# EAGLE schematic GBox2-can_diy (EAGLE 6.6.0)
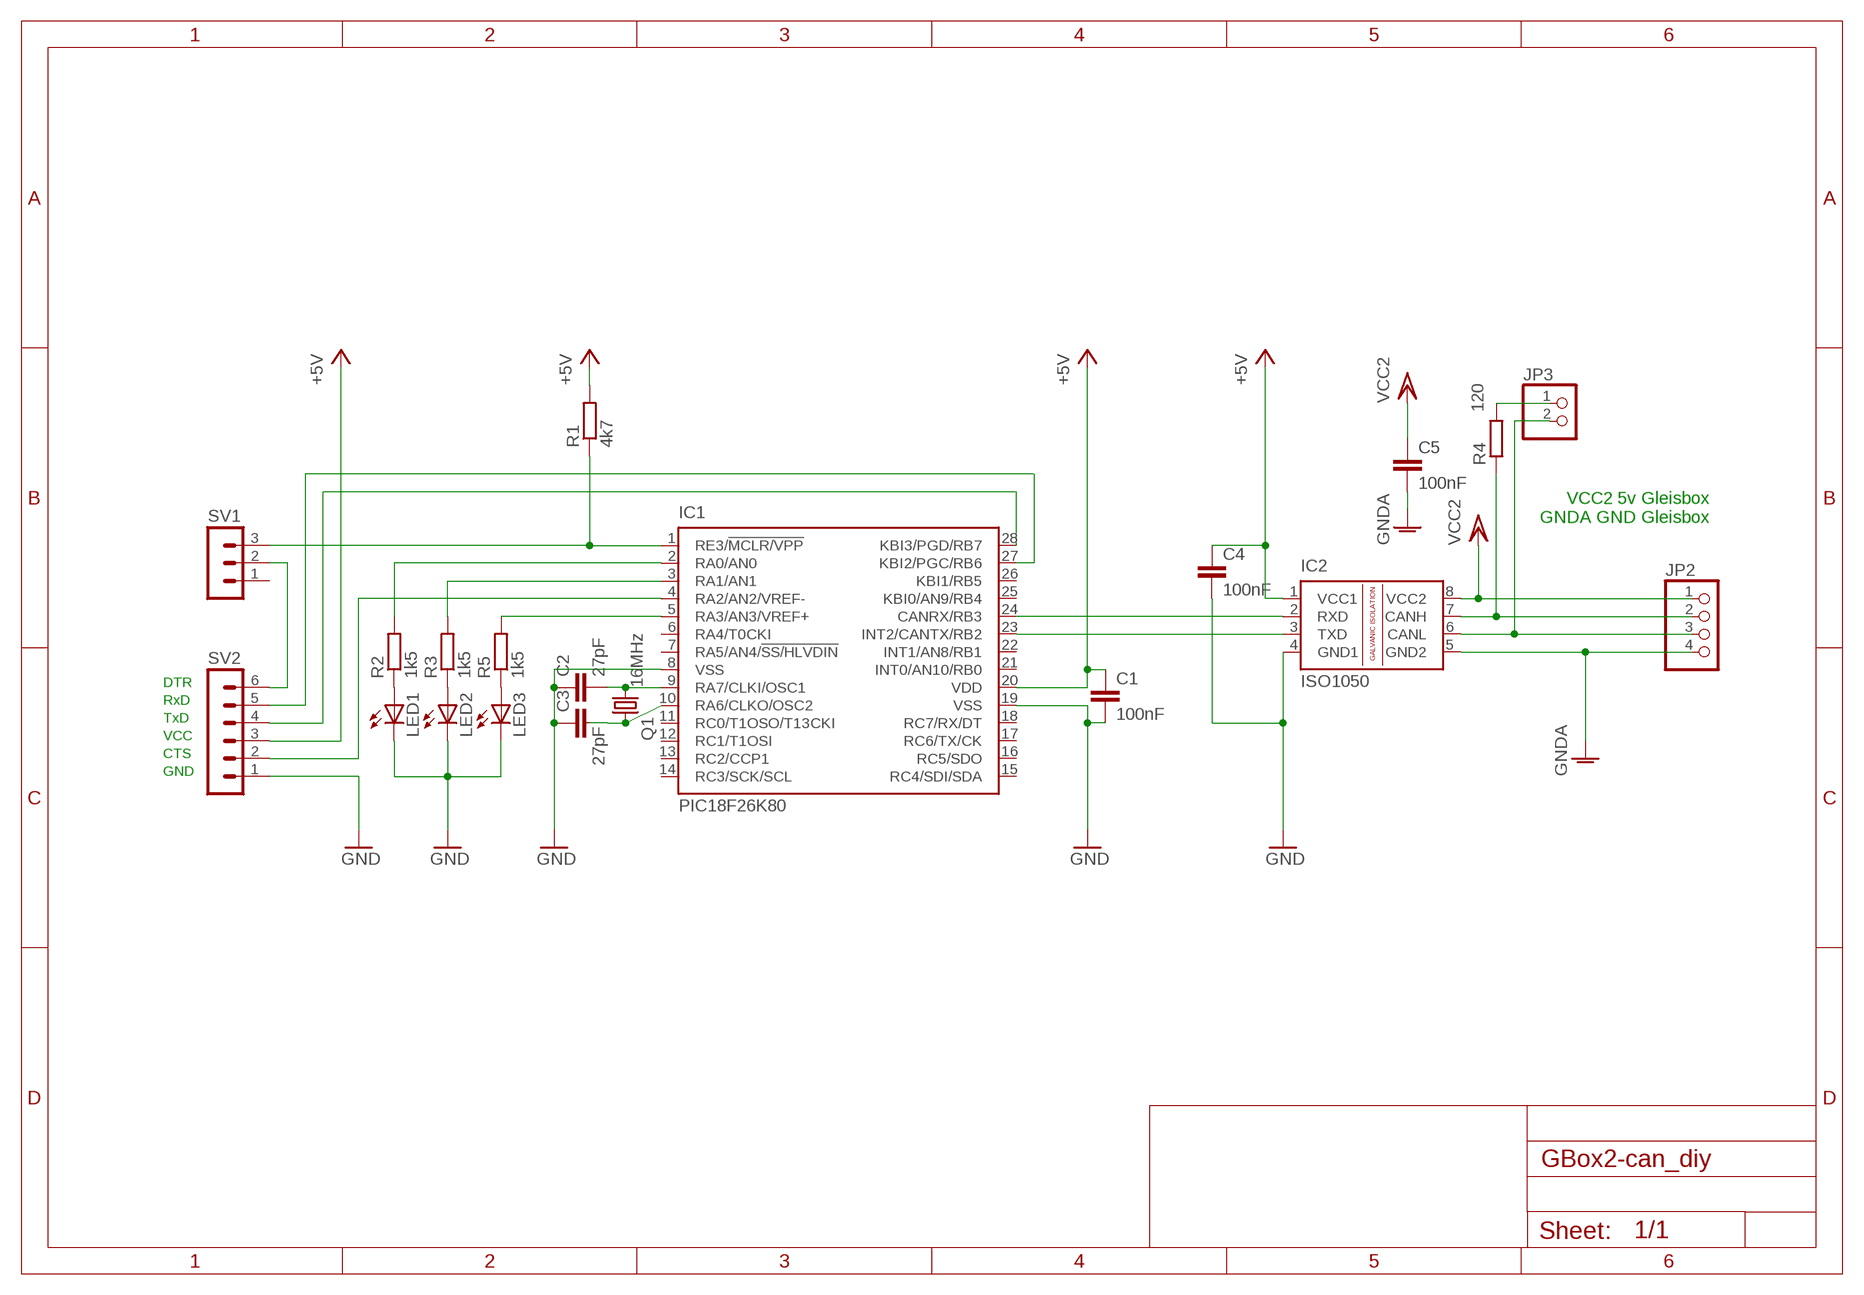
[diagram p0: schematic, sheet 1]

## Parts
C1  100nF  C-EUC1206  [C1206]
C2  27pF  C-EUC1206  [C1206]
C3  27pF  C-EUC1206  [C1206]
C4  100nF  C-EUC1206  [C1206]
C5  100nF  C-EUC1206  [C1206]
IC1  PIC18F26K80  PIC18F26K80-E/SO  [SO28W]
IC2  ISO1050  ISO1050DUB  [DUB-R-PDSO-G8]
JP2  PINHD-1X4  [1X04]
JP3  PINHD-1X2  [1X02]
LED1  LEDSML1206  [SML1206]
LED2  LEDSML1206  [SML1206]
LED3  LEDSML1206  [SML1206]
Q1  16MHz  CRYSTALHC49UP  [HC49UP]
R1  4k7  R-EU_R1206  [R1206]
R2  1k5  R-EU_R1206  [R1206]
R3  1k5  R-EU_R1206  [R1206]
R4  120  R-EU_0204/7  [0204/7]
R5  1k5  R-EU_R1206  [R1206]
SV1  MA03-1  [MA03-1]
SV2  MA06-1  [MA06-1]

## Nets
+5V: C1.1 C4.1 IC1.20(VDD) IC2.1(VCC1) R1.2 SV2.3
GND: C1.2 C2.1 C3.1 C4.2 IC1.8(VSS) IC1.19(VSS) IC2.4(GND1) LED1.C LED2.C LED3.C SV2.1
GNDA: C5.2 IC2.5(GND2) JP2.4
N$1: IC1.2(RA0/AN0) R2.2
N$2: IC1.3(RA1/AN1) R3.2
N$3: C2.2 IC1.9(RA7/CLKI/OSC1) Q1.2
N$4: C3.2 IC1.10(RA6/CLKO/OSC2) Q1.1
N$5: LED2.A R3.1
N$6: IC1.1(RE3/!MCLR/VPP) R1.1 SV1.3
N$7: IC1.27(KBI2/PGC/RB6) SV2.5
N$8: LED3.A R5.1
N$9: IC1.28(KBI3/PGD/RB7) SV2.4
N$11: IC1.5(RA3/AN3/VREF+) R5.2
N$12: SV1.2 SV2.6
N$13: IC1.4(RA2/AN2/VREF-) SV2.2
N$15: IC1.23(INT2/CANTX/RB2) IC2.3(TXD)
N$16: JP3.1 R4.2
N$17: LED1.A R2.1
N$19: IC1.24(CANRX/RB3) IC2.2(RXD)
N$24: IC2.6(CANL) JP2.3 JP3.2
N$25: IC2.7(CANH) JP2.2 R4.1
VCC/2: C5.1 IC2.8(VCC2) JP2.1 ; supply symbol labelled VCC2
Unconnected: IC1.6(RA4/T0CKI) IC1.7(RA5/AN4/!SS/HLVDIN) IC1.11(RC0/T1OSO/T13CKI) IC1.12(RC1/T1OSI) IC1.13(RC2/CCP1) IC1.14(RC3/SCK/SCL) IC1.15(RC4/SDI/SDA) IC1.16(RC5/SDO) IC1.17(RC6/TX/CK) IC1.18(RC7/RX/DT) IC1.21(INT0/AN10/RB0) IC1.22(INT1/AN8/RB1) IC1.25(KBI0/AN9/RB4) IC1.26(KBI1/RB5) SV1.1

## Notes on the sheet
- VCC2 5v Gleisbox
  GNDA GND Gleisbox
- DTR
- RxD
- TxD
- VCC
- CTS
- GND

## Library data of the parts
C1-C5 = resistor:C-EU: CAPACITOR, European symbol
IC1 = PIC18F26K80:PIC18F26K80: 28-Pin Enhanced Flash Microcontrollers with ECAN(TM) Technology 10-Bit A/D and nanoWatt Technology Source: http://www.microchip.com .. 39637a.pdf
IC2 = texas:ISO1050: ISOLATED CAN TRANSCEIVER Source: http://focus.ti.com/lit/ds/symlink/iso1050.pdf; MPN: ISO1050DUBR; OC_FARNELL: 1755712; OC_NEWARK: 14R9899
JP2 = pinhead:PINHD-1X4: PIN HEADER
JP3 = pinhead:PINHD-1X2: PIN HEADER
LED1-LED3 = led:LED: LED OSRAM: - CHIPLED LG R971, LG N971, LY N971, LG Q971, LY Q971, LO R971, LY R971 LH N974, LH R974 LS Q976, LO Q976, LY Q976 LO Q996 - Hyper CHIPLED LW Q18S LB Q993, LB Q99A, LB R99A - SideLED LS A670, LO A670, LY A670, LG A670, LP A670 LB A673, LV A673, LT A673, LW A673 LH A674 LY A675 LS A676, LA A676, LO A676, LY A676, LW A676 LS A679, LY A679, LG A679 - Hyper Micro SIDELED® LS Y876, LA Y876, LO Y876, LY Y876 LT Y87S - SmartLED LW L88C, LW L88S LB L89C, LB L89S, LG L890 LS L89K, LO L89K, LY L89K LS L896, LA L896, LO L896, LY L896 - TOPLED LS T670, LO T670, LY T670, LG T670, LP T670 LSG T670, LSP T670, LSY T670, LOP T670, LYG T670 LG T671, LOG T671, LSG T671 LB T673, LV T673, LT T673, LW T673 LH T674 LS T676, LA T676, LO T676, LY T676, LB T676, LH T676, LSB T676, LW T676 LB T67C, LV T67C, LT T67C, LS T67K, LO T67K, LY T67K, LW E67C LS E67B, LA E67B, LO E67B, LY E67B, LB E67C, LV E67C, LT E67C LW T67C LS T679, LY T679, LG T679 LS T770, LO T770, LY T770, LG T770, LP T770 LB T773, LV T773, LT T773, LW T773 LH T774 LS E675, LA E675, LY E675, LS T675 LS T776, LA T776, LO T776, LY T776, LB T776 LHGB T686 LT T68C, LB T68C - Hyper Mini TOPLED® LB M676 - Mini TOPLED Santana® LG M470 LS M47K, LO M47K, LY M47K Source: http://www.osram.convergy.de LUXEON: - LUMILED® LXK2-PW12-R00, LXK2-PW12-S00, LXK2-PW14-U00, LXK2-PW14-V00 LXK2-PM12-R00, LXK2-PM12-S00, LXK2-PM14-U00 LXK2-PE12-Q00, LXK2-PE12-R00, LXK2-PE12-S00, LXK2-PE14-T00, LXK2-PE14-U00 LXK2-PB12-K00, LXK2-PB12-L00, LXK2-PB12-M00, LXK2-PB14-N00, LXK2-PB14-P00, LXK2-PB14-Q00 LXK2-PR12-L00, LXK2-PR12-M00, LXK2-PR14-Q00, LXK2-PR14-R00 LXK2-PD12-Q00, LXK2-PD12-R00, LXK2-PD12-S00 LXK2-PH12-R00, LXK2-PH12-S00 LXK2-PL12-P00, LXK2-PL12-Q00, LXK2-PL12-R00 Source: www.luxeon.com KINGBRIGHT: KA-3528ASYC Source: www.kingbright.com
Q1 = crystal:CRYSTAL: CRYSTAL; OC_FARNELL: unknown; OC_NEWARK: unknown
R1-R5 = resistor:R-EU_: RESISTOR, European symbol
SV1 = con-lstb:MA03-1: PIN HEADER; OC_FARNELL: unknown; OC_NEWARK: unknown
SV2 = con-lstb:MA06-1: PIN HEADER; OC_FARNELL: unknown; OC_NEWARK: unknown